# EAGLE design remotecontrol (EAGLE 9.6.2)
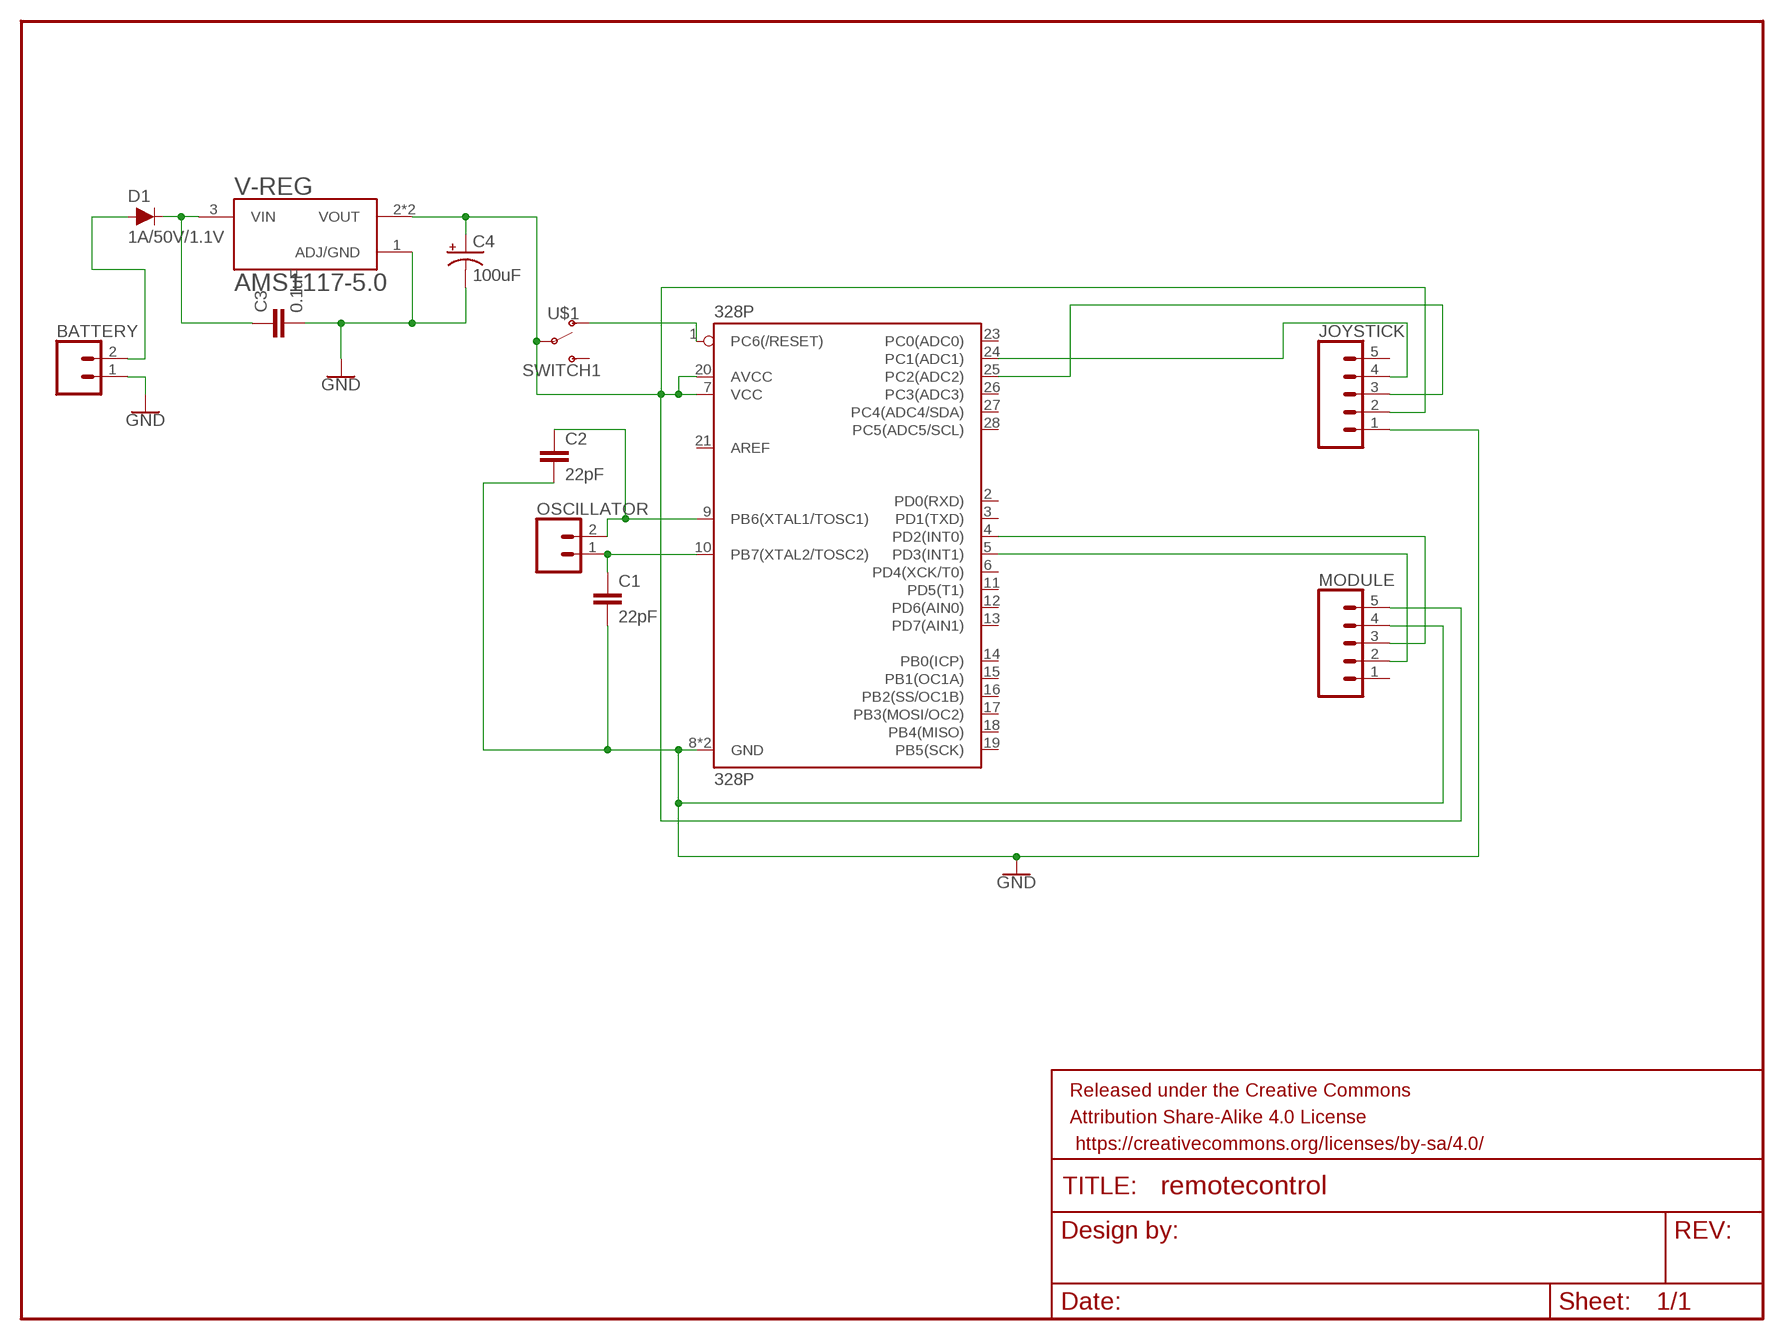
[diagram p0: schematic, sheet 1]

## Parts
328P  328P  ATMEGA328P_PDIP  [DIP28]
BATTERY  CONN_02  [1X02]
C1  22pF  22PF-0603-50V-5%  [0603]
C2  22pF  22PF-0603-50V-5%  [0603]
C3  0.1uF  0.1UF-0603-25V-(+80/-20%)  [0603]
C4  100uF  100UF-POLAR-10X10.5-63V-20%  [NIC_10X10.5_CAP]
D1  1A/50V/1.1V  DIODE-PTH  [DIODE-1N4001]
FRAME1  FRAME-LETTER  [CREATIVE_COMMONS]
JOYSTICK  CONN_05  [1X05]
MODULE  CONN_05  [1X05]
OSCILLATOR  CONN_02  [1X02]
U$1  SWITCH1  [SWITCH1]
V-REG  AMS1117-5.0  [SOT229P700X180-4N]

## Nets
GND: 328P.8(GND) 328P.22(GND) BATTERY.1 C1.2 C2.2 C3.2 C4.- JOYSTICK.1 MODULE.4 V-REG.1(ADJ/GND)
JOYSTICK: 328P.24(PC1(ADC1)) JOYSTICK.4
N$1: 328P.5(PD3(INT1)) MODULE.2
N$2: 328P.4(PD2(INT0)) MODULE.3
N$3: BATTERY.2 D1.A
N$4: 328P.25(PC2(ADC2)) JOYSTICK.3
N$5: C3.1 D1.C V-REG.3(VIN)
N$6: 328P.10(PB7(XTAL2/TOSC2)) C1.1 OSCILLATOR.1
N$7: 328P.9(PB6(XTAL1/TOSC1)) C2.1 OSCILLATOR.2
N$8: 328P.1(PC6(/RESET)) U$1.P$3(O)
N$9: 328P.7(VCC) 328P.20(AVCC) C4.+ JOYSTICK.2 MODULE.5 U$1.P$2(P) V-REG.2(VOUT) V-REG.4(VOUT)
Unconnected: 328P.2(PD0(RXD)) 328P.3(PD1(TXD)) 328P.6(PD4(XCK/T0)) 328P.11(PD5(T1)) 328P.12(PD6(AIN0)) 328P.13(PD7(AIN1)) 328P.14(PB0(ICP)) 328P.15(PB1(OC1A)) 328P.16(PB2(SS/OC1B)) 328P.17(PB3(MOSI/OC2)) 328P.18(PB4(MISO)) 328P.19(PB5(SCK)) 328P.21(AREF) 328P.23(PC0(ADC0)) 328P.26(PC3(ADC3)) 328P.27(PC4(ADC4/SDA)) 328P.28(PC5(ADC5/SCL)) JOYSTICK.5 MODULE.1 U$1.P$1(S)

## Library data of the parts
328P = SparkFun-IC-Microcontroller:ATMEGA328P_PDIP: Atmel 328P Through hole ATMEGA328P uC used in the Arduino 32kb flash, 1k EEPROM, 2k SRAM Datasheet <http://www.sparkfun.com/datasheets/Components/SMD/ATMega328.pdf> SparkFun Products Storefront component: AVR 28 Pin 20MHz 32K 6A/D - ATMega328P <https://www.sparkfun.com/products/9061> (COM-09061) SparkFun Simon Says - Through-Hole Soldering Kit <https://www.sparkfun.com/products/10547> (KIT-10547) SparkFun Learn to Solder - Simon Says <https://www.sparkfun.com/products/13708> (KIT-13708) SparkFun BigTime Watch Kit <https://www.sparkfun.com/products/11734> (KIT-11734) SparkFun ClockIt <https://www.sparkfun.com/products/10930> (KIT-10930) SparkFun Serial Enabled LCD Kit <https://www.sparkfun.com/products/10097> (LCD-10097) SparkFun Simon Tilts - Through Hole Soldering Kit <https://www.sparkfun.com/products/12634> (KIT-12634) SparkFun Frequency Counter Kit <https://www.sparkfun.com/products/10140> (KIT-10140) FabFM Radio Kit <https://www.sparkfun.com/products/11043> (KIT-11043) SparkFun Binary Blaster Kit <https://www.sparkfun.com/products/12037> (KIT-12037) SparkFun Metro-Gnome <https://www.sparkfun.com/products/9236> (KIT-09236) ATmega328 with Arduino Optiboot (Uno) <https://www.sparkfun.com/products/10524> (DEV-10524); PROD_ID: IC-09136
BATTERY OSCILLATOR = SparkFun-Connectors:CONN_02: Multi connection point. Often used as Generic Header-pin footprint for 0.1 inch spaced/style header connections On any of the 0.1 inch spaced packages, you can populate with these: Break Away Headers - Straight <https://www.sparkfun.com/products/116> (PRT-00116) Break Away Male Headers - Right Angle <https://www.sparkfun.com/products/553> (PRT-00553) Female Headers <https://www.sparkfun.com/products/115> (PRT-00115) Break Away Headers - Machine Pin <https://www.sparkfun.com/products/117> (PRT-00117) Break Away Female Headers - Swiss Machine Pin <https://www.sparkfun.com/products/743> (PRT-00743) For SCREWTERMINALS and SPRING TERMINALS visit here: Screw Terimnals on SparkFun.com <https://www.sparkfun.com/search/results?term=Screw+Terminals> (5mm/3.5mm/2.54mm spacing) This device is also useful as a general connection point to wire up your design to another part of your project. Our various solder wires solder well into these plated through hole pads. Hook-Up Wire - Assortment (Stranded, 22 AWG) <https://www.sparkfun.com/products/11375> (PRT-11375) Hook-Up Wire - Assortment (Solid Core, 22 AWG) <https://www.sparkfun.com/products/11367> (PRT-11367) View the entire wire category on our website here <https://www.sparkfun.com/categories/141> Special notes: Molex polarized connector foot print use with: PRT-08233 with associated crimp pins and housings. 2.54_SCREWTERM for use with PRT-10571. 3.5mm Screw Terminal footprints for PRT-08084 5mm Screw Terminal footprints for use with PRT-08432
C1 C2 = SparkFun-Capacitors:22PF: 22pF ceramic capacitors A capacitor is a passive two-terminal electrical component used to store electrical energy temporarily in an electric field.; PROD_ID: CAP-07876
C3 = SparkFun-Capacitors:0.1UF: 0.1µF ceramic capacitors A capacitor is a passive two-terminal electrical component used to store electrical energy temporarily in an electric field.; PROD_ID: CAP-00810
C4 = SparkFun-Capacitors:100UF-POLAR: 100µF polarized capacitors A capacitor is a passive two-terminal electrical component used to store electrical energy temporarily in an electric field.; PROD_ID: CAP-08362
D1 = SparkFun-DiscreteSemi:DIODE: Diode These are standard reverse protection diodes and small signal diodes. SparkFun Products: SparkFun SparkPunk Sound Kit <https://www.sparkfun.com/products/11177> SparkFun ESP8266 Thing <https://www.sparkfun.com/products/13231>; PROD_ID: DIO-09176
FRAME1 = SparkFun-Aesthetics:FRAME-LETTER: Schematic Frame - Letter Standard 8.5x11 US Letter frame
JOYSTICK MODULE = SparkFun-Connectors:CONN_05: Multi connection point. Often used as Generic Header-pin footprint for 0.1 inch spaced/style header connections On any of the 0.1 inch spaced packages, you can populate with these: Break Away Headers - Straight <https://www.sparkfun.com/products/116> (PRT-00116) Break Away Male Headers - Right Angle <https://www.sparkfun.com/products/553> (PRT-00553) Female Headers <https://www.sparkfun.com/products/115> (PRT-00115) Break Away Headers - Machine Pin <https://www.sparkfun.com/products/117> (PRT-00117) Break Away Female Headers - Swiss Machine Pin <https://www.sparkfun.com/products/743> (PRT-00743) For SCREWTERMINALS and SPRING TERMINALS visit here: Screw Terimnals on SparkFun.com <https://www.sparkfun.com/search/results?term=Screw+Terminals> (5mm/3.5mm/2.54mm spacing) This device is also useful as a general connection point to wire up your design to another part of your project. Our various solder wires solder well into these plated through hole pads. Hook-Up Wire - Assortment (Stranded, 22 AWG) <https://www.sparkfun.com/products/11375> (PRT-11375) Hook-Up Wire - Assortment (Solid Core, 22 AWG) <https://www.sparkfun.com/products/11367> (PRT-11367) View the entire wire category on our website here <https://www.sparkfun.com/categories/141> Special notes: Molex polarized connector foot print use with SKU : PRT-08231 with associated crimp pins and housings. 1MM SMD Version SKU: PRT-10208
U$1 = My Lib:SWITCH1
V-REG = AMS1117-5.0:AMS1117-5.0: Sot223/Pkg 1-Amp 5-Volt Low Drop Out Voltage Regulatator Check prices <https://pricing.snapeda.com/parts/AMS1117-5.0/Advanced%20Monolithic%20Systems/view-part?ref=eda>; AVAILABILITY: In Stock; DESCRIPTION: Sot223/Pkg 1-Amp 5-Volt Low Drop Out Voltage Regulatator; MF: Advanced Monolithic Systems; MP: AMS1117-5.0; PACKAGE: SOT-223 Seeed Technology; PRICE: None

## Board
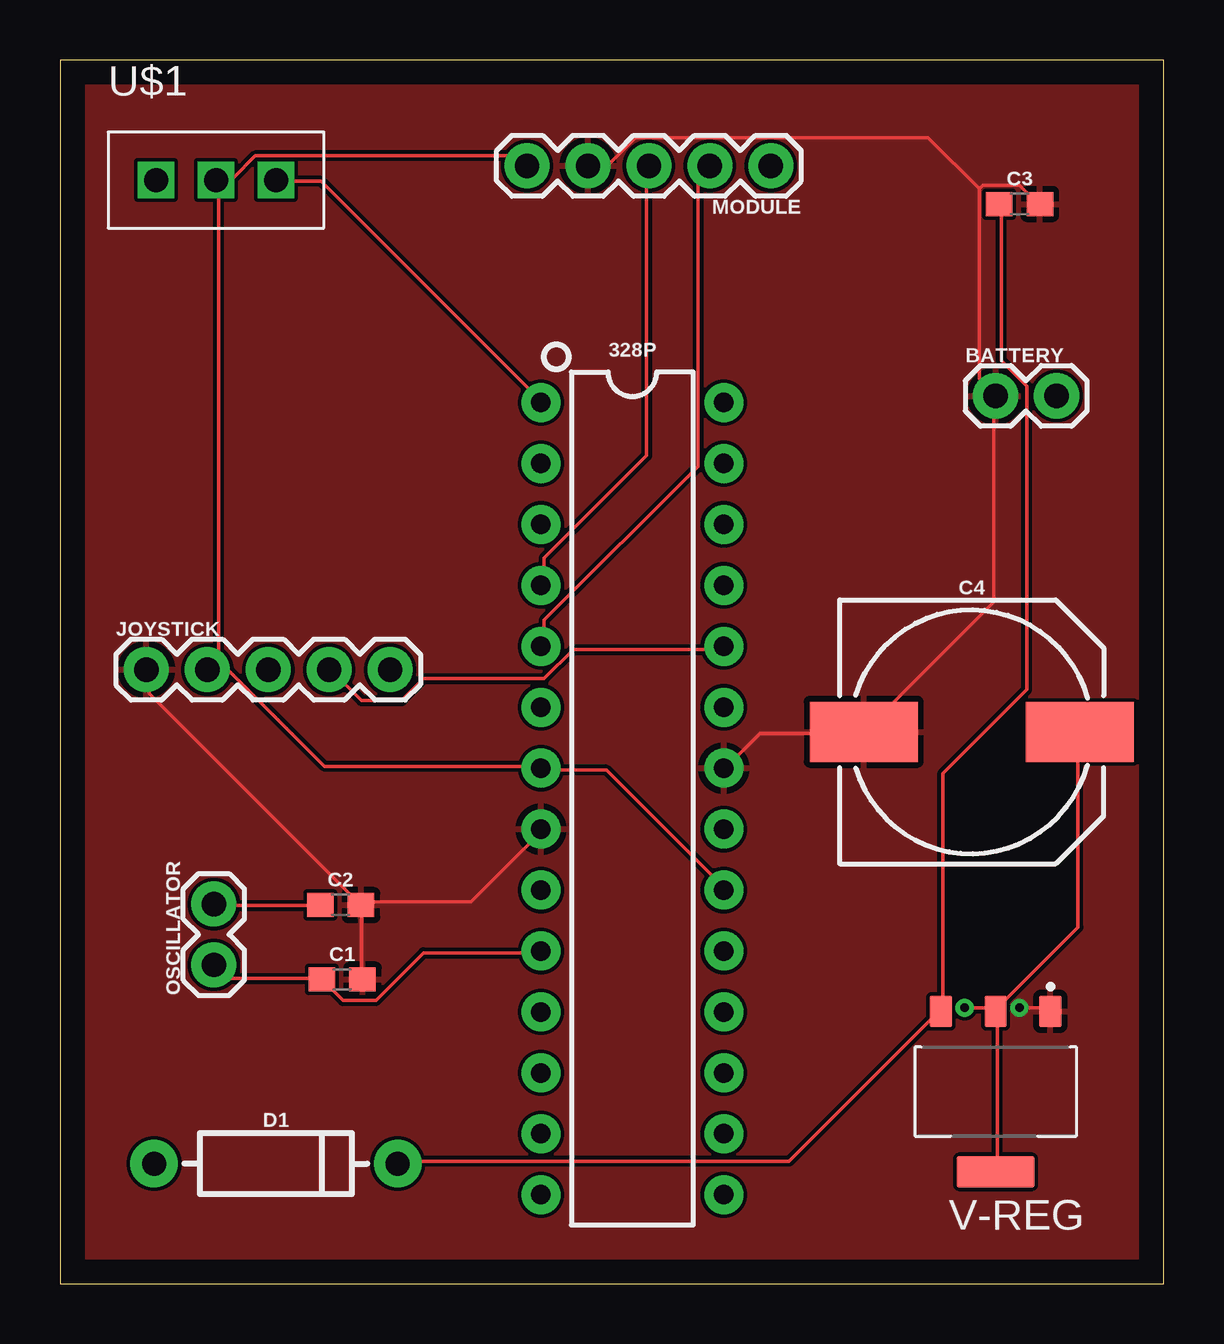
[diagram p1: board, top side]
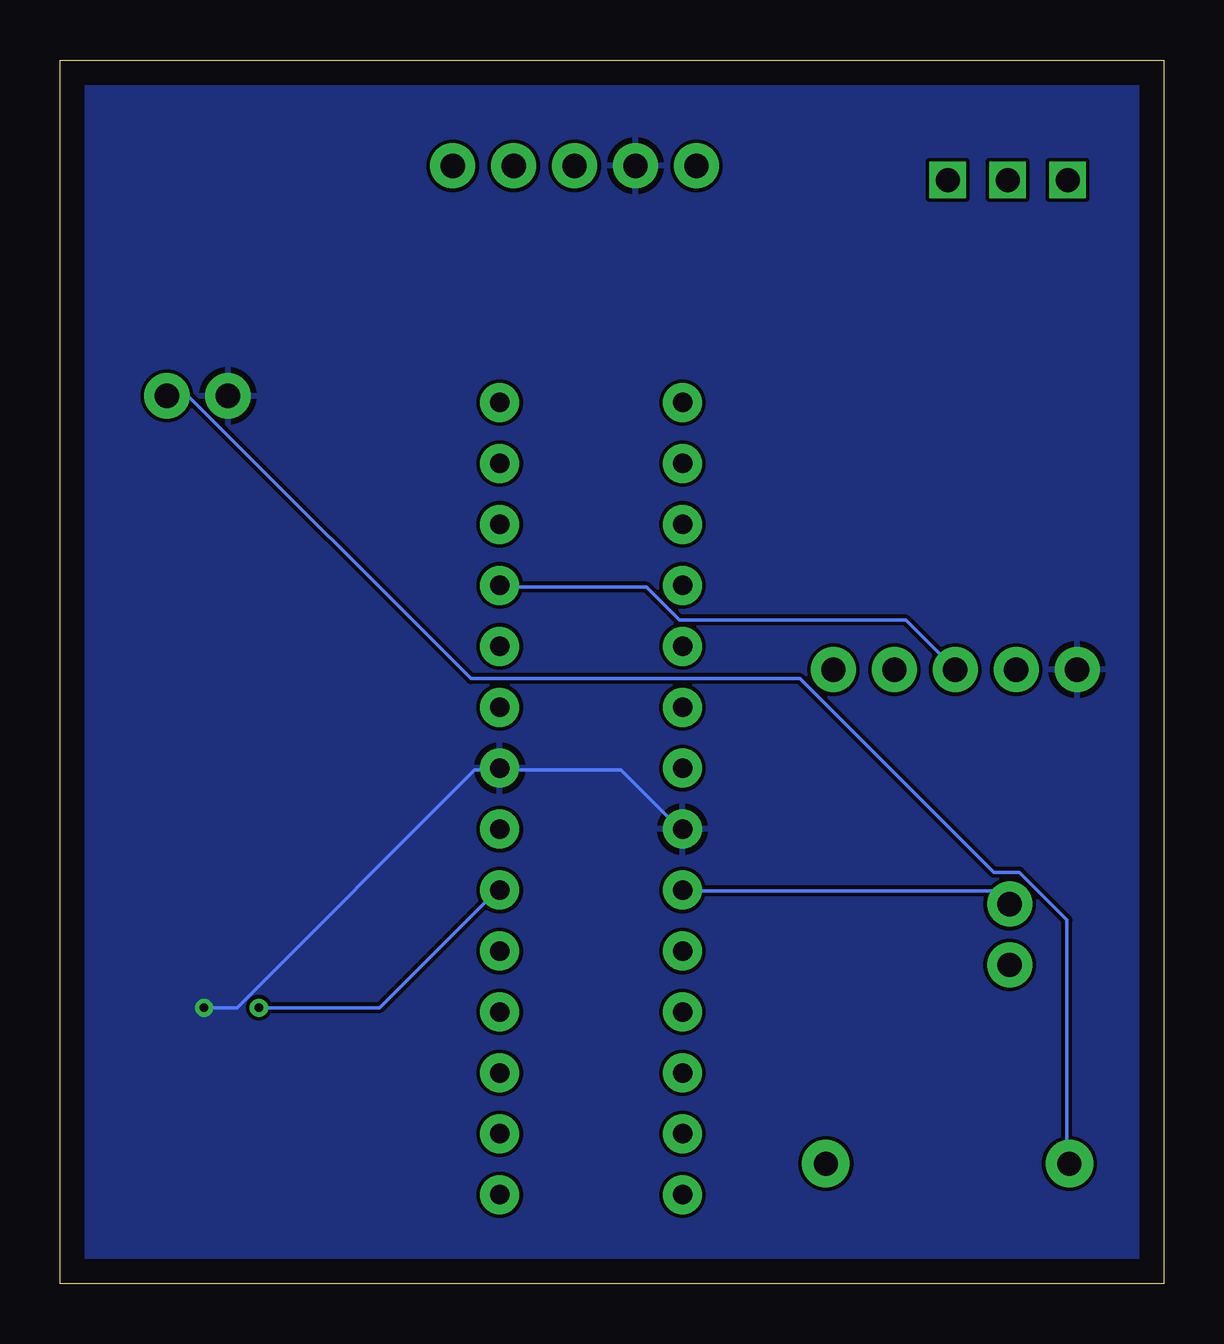
[diagram p2: board, bottom side, seen from below]

Size 46 x 51 mm. Coordinates in mm from the lower left corner, seen from the top.
Outline: 0,0 46,0 46,51 0,51 0,0
Copper layers (1*16): Top 0.035mm / dielectric 1.5mm / Bottom 0.035mm
Design rules "default": minimum track width 6mil, minimum drill 0.35mm, track to track 6mil, track to pad 6mil, pad to pad 6mil, via to via 6mil, smd to smd 6mil, copper to edge 40mil, drill to drill 6mil, minimum pad ring 10mil, minimum via ring 8mil, stop-mask expansion 4mil, vias tented up to drill 0mil, thermal gap 10mil

### Footprints (pad centres in the part's own frame; a part is rotated, then mirrored left to right if it is on the bottom)
DIP28 = drill 0.813 pad 1.626: 1 -16.51,-3.81; 2 -13.97,-3.81; 3 -11.43,-3.81; 4 -8.89,-3.81; 5 -6.35,-3.81; 6 -3.81,-3.81; 7 -1.27,-3.81; 8 1.27,-3.81; 9 3.81,-3.81; 10 6.35,-3.81; 11 8.89,-3.81; 12 11.43,-3.81; 13 13.97,-3.81; 14 16.51,-3.81; 15 16.51,3.81; 16 13.97,3.81; 17 11.43,3.81; 18 8.89,3.81; 19 6.35,3.81; 20 3.81,3.81; 21 1.27,3.81; 22 -1.27,3.81; 23 -3.81,3.81; 24 -6.35,3.81; 25 -8.89,3.81; 26 -11.43,3.81; 27 -13.97,3.81; 28 -16.51,3.81
1X02 = drill 1.016 pad 1.88: 1 0,0; 2 2.54,0
0603 = smd 1.1 x 1: 1 -0.85,0; 2 0.85,0
NIC_10X10.5_CAP = smd 4.5 x 2.5: + 4.5,0; - -4.5,0
DIODE-1N4001 = drill 1 pad 1.981: A -5.08,0; C 5.08,0
1X05 = drill 1.016 pad 1.88: 1 0,0; 2 2.54,0; 3 5.08,0; 4 7.62,0; 5 10.16,0
SWITCH1 = drill 1 square: P$1 0,0; P$2 2.5,0; P$3 5,0
SOT229P700X180-4N = smd 0.93 x 1.31: 1 -2.29,-3.345; 2 0,-3.345; 3 2.29,-3.345 | smd 3.24 x 1.31: 4 0,3.345

### Placement (x,y rotation side)
328P  23.86,20.21 270 top
BATTERY  39,37 0 top
C1  11.76,12.67 0 top
C2  11.7,15.78 0 top
C3  40,45 0 top
C4  38,23 0 top
D1  9,5 0 top
FRAME1  -81.01,10.43 0 top  (outside the outline)
JOYSTICK  3.6,25.59 0 top
MODULE  29.63,46.59 180 top
OSCILLATOR  6.41,13.28 90 top
U$1  4,46 0 top
V-REG  39,8 180 top

### Tracks (layer width: path | path; a pad name or v marks a point on that pad's centre or on a via)
GND  (via drill 0.35)
  Top 0.152: 38.32,45.63 38.47,45.79 40,45.79 40.76,45.02 C3.2 | 38.32,45.63 38.32,37.71 38.93,37.1 BATTERY.1 38.93,36.95 38.93,28.41 33.59,23.08 C4.- 33.44,22.93 29.18,22.93 27.8,21.55 328P.22 | 38.32,45.63 36.19,47.77 23.99,47.77 22.93,46.7 22.01,46.7 MODULE.4 | v40,11.5 41.22,11.5 V-REG.1 | C1.2 12.56,12.72 12.56,15.76 C2.2 | C2.2 12.56,15.92 17.14,15.92 20.03,18.81 328P.8 | JOYSTICK.1 3.72,25.52 3.72,24.6 12.41,15.92 C2.2
  Bottom 0.152: v40,11.5 38.62,11.5 28.72,21.4 27.8,21.4 328P.22 27.65,21.4 22.62,21.4 20.18,18.96 328P.8
  pour Top: 0.25,0.25 0.25,50.75 45.75,50.75 45.75,0.25
  pour Bottom: 0.25,0.25 0.25,50.75 45.75,50.75 45.75,0.25
JOYSTICK
  Top 0.152: 328P.24 27.65,26.43 21.4,26.43 20.18,25.21 15.15,25.21 14.24,24.3 12.56,24.3 11.34,25.52 JOYSTICK.4
N$1
  Top 0.152: 328P.5 20.18,26.58 20.18,27.65 26.58,34.05 26.58,46.09 27.04,46.55 MODULE.2
N$2
  Top 0.152: 328P.4 20.18,29.18 20.18,30.24 24.45,34.51 24.45,46.55 MODULE.3
N$3
  Bottom 0.152: BATTERY.2 41.52,36.95 40.6,36.95 28.87,25.21 15.15,25.21 7.08,17.14 6.01,17.14 4.03,15.15 4.03,5.1 D1.A
N$4
  Bottom 0.152: 328P.25 27.65,29.02 21.55,29.02 20.18,27.65 10.73,27.65 8.75,25.67 JOYSTICK.3
N$5
  Top 0.152: C3.1 39.23,44.87 39.23,38.47 40.3,37.41 40.3,24.76 36.8,21.25 36.8,11.5 V-REG.3 36.64,11.34 30.39,5.1 14.09,5.1 D1.C
N$6
  Top 0.152: OSCILLATOR.1 6.47,13.17 6.92,12.72 10.89,12.72 C1.1 11.04,12.56 11.8,11.8 13.17,11.8 15.15,13.78 20.03,13.78 328P.10
N$7
  Top 0.152: C2.1 10.73,15.76 6.47,15.76 OSCILLATOR.2
  Bottom 0.152: 328P.9 20.03,16.37 6.92,16.37 6.47,15.92 OSCILLATOR.2
N$8
  Top 0.152: U$1.P$3 9.06,45.94 10.89,45.94 20.03,36.8 328P.1
N$9  (via drill 0.35)
  Top 0.152: V-REG.2 39.08,11.34 39.08,4.79 V-REG.4 | C4.+ 42.43,22.93 42.43,14.85 39.08,11.5 V-REG.2 | MODULE.5 19.42,46.7 19.12,47.01 8.14,47.01 7.23,46.09 6.62,46.09 U$1.P$2 6.62,45.94 6.62,25.52 | 328P.20 27.65,16.53 22.77,21.4 20.18,21.4 328P.7 20.03,21.55 11.04,21.55 7.08,25.52 6.62,25.52 | 6.62,25.52 6.16,25.52 JOYSTICK.2 6.62,25.52 | v37.71,11.5 38.93,11.5 V-REG.2
  Bottom 0.152: v37.71,11.5 32.68,11.5 27.8,16.37 328P.20